# Altium schematic sheet NFCY_BaseBoard.SchDoc: NFCY-BaseBoard
size A3; Author: 怒飞垂云; DrawnBy: 怒飞垂云; Engineer: 怒飞垂云; Organization: NFCY; DocumentNumber: 1; Revision: V2.0; SheetNumber: 1; SheetTotal: 1
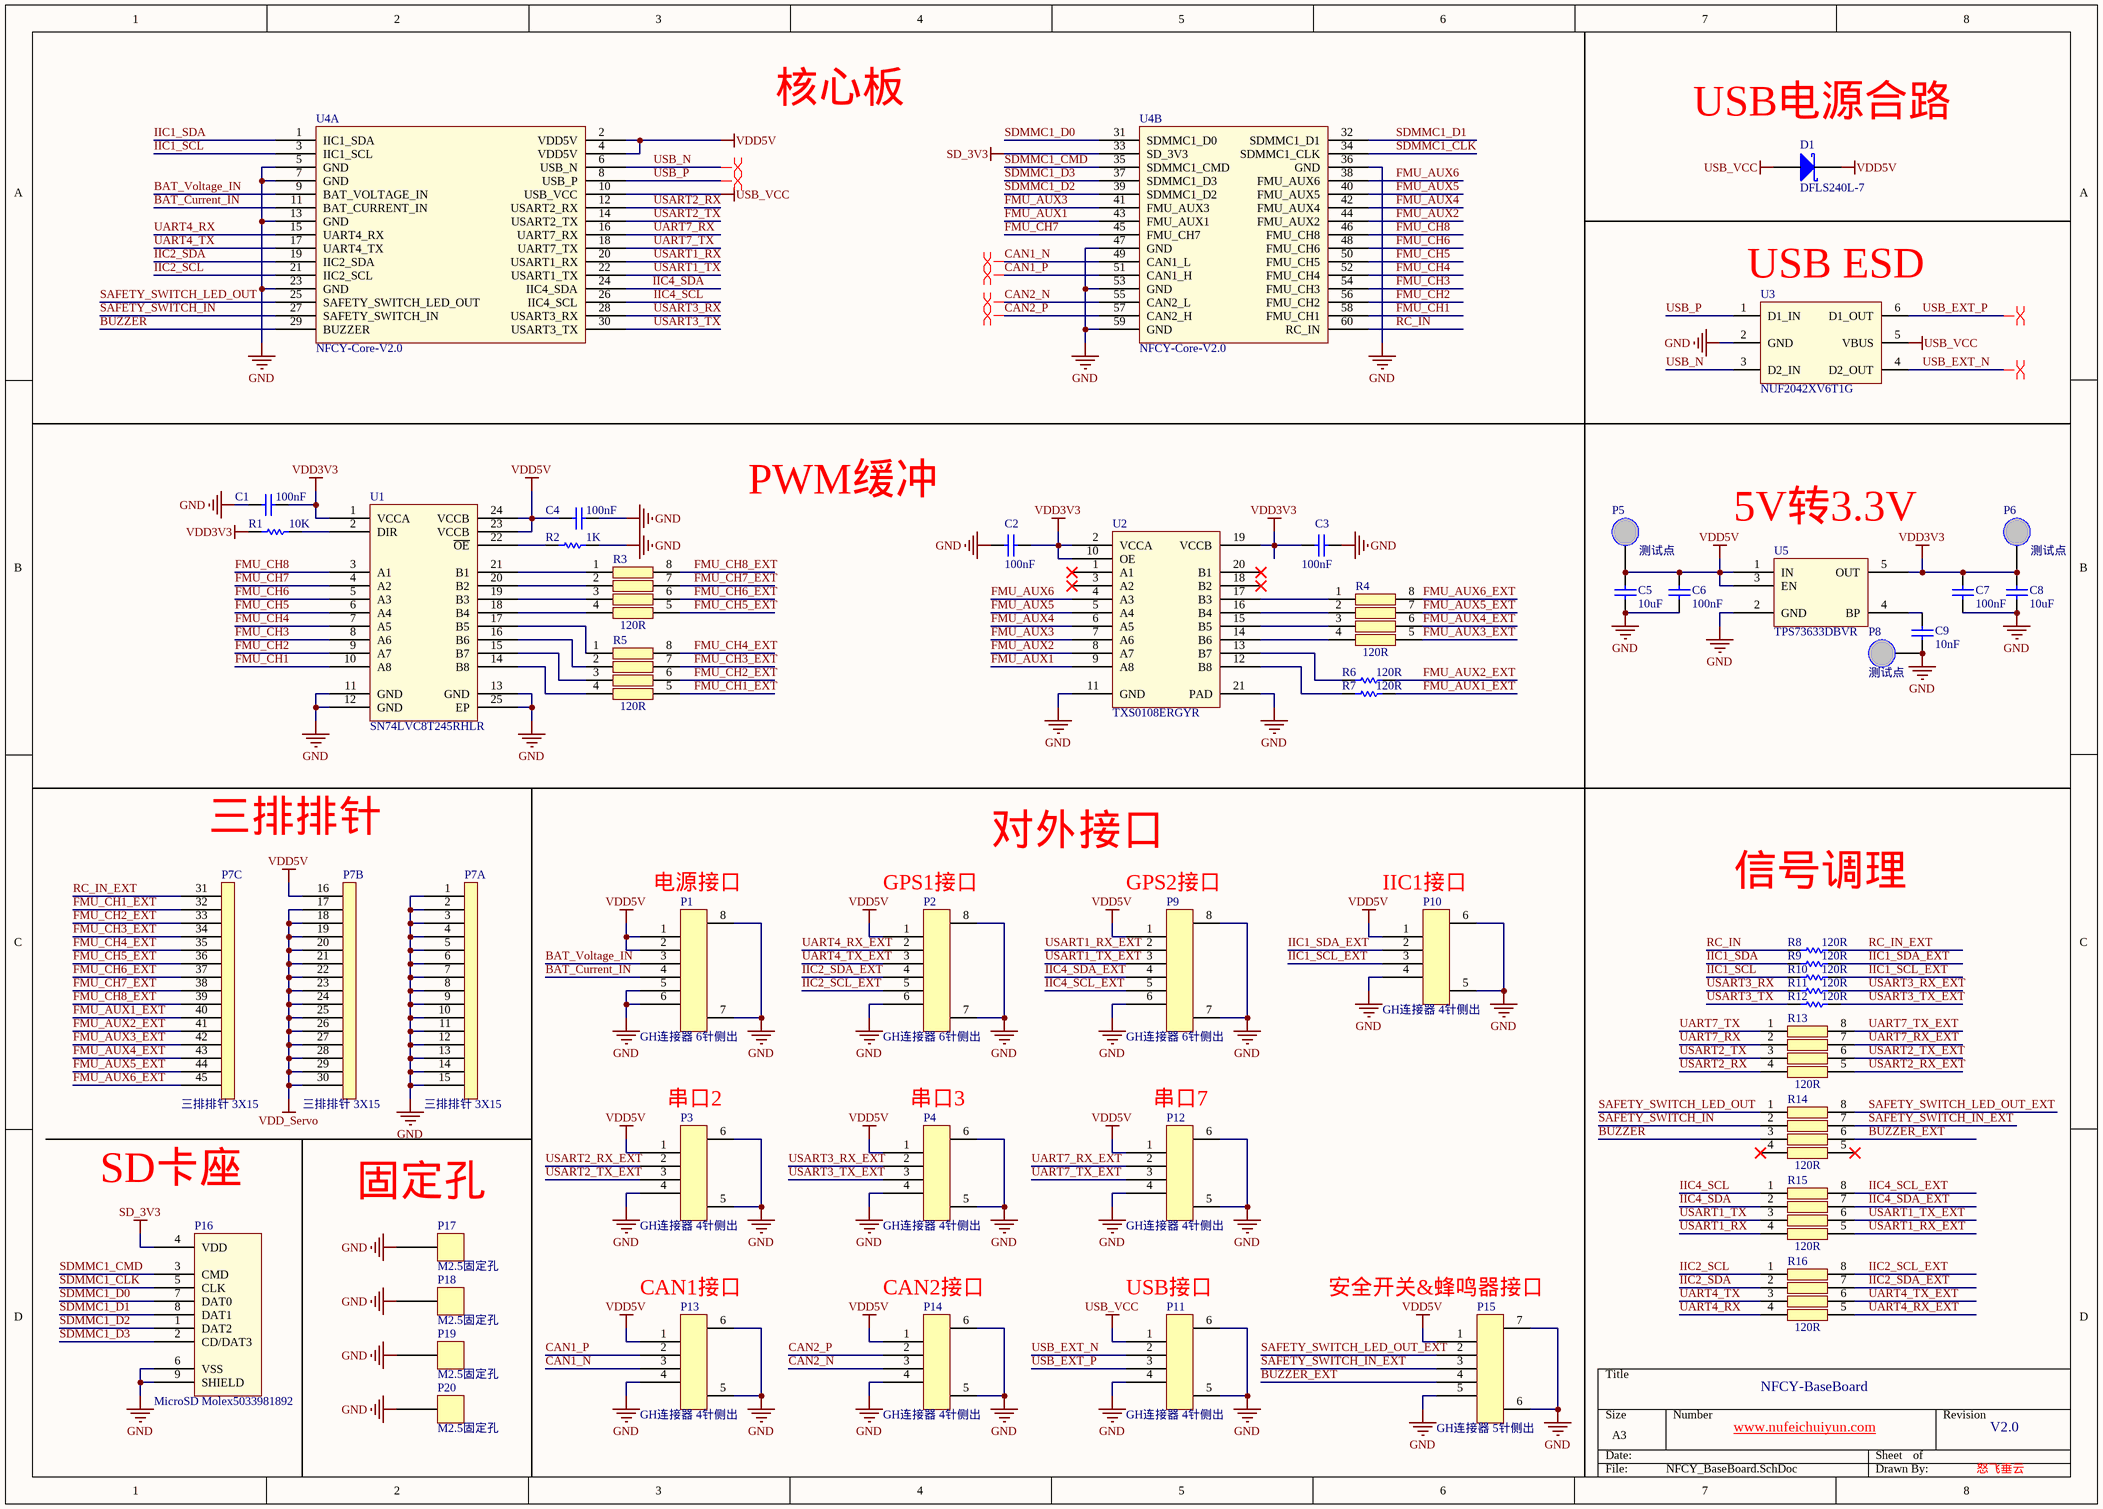
[diagram p0: NFCY_BaseBoard.SchDoc]

## Parts
C1  value 100nF  [CAP0402]  (hidden comment: CL05B104KO5NNNC)
C2  value 100nF  [CAP0402]  (hidden comment: CL05B104KO5NNNC)
C3  value 100nF  [CAP0402]  (hidden comment: CL05B104KO5NNNC)
C4  value 100nF  [CAP0402]  (hidden comment: CL05B104KO5NNNC)
C5  value 10uF  [CAP0805]  (hidden comment: CL21A106KAYNNNE)
C6  value 100nF  [CAP0402]  (hidden comment: CL05B104KO5NNNC)
C7  value 100nF  [CAP0402]  (hidden comment: CL05B104KO5NNNC)
C8  value 10uF  [CAP0805]  (hidden comment: CL21A106KAYNNNE)
C9  value 10nF  [CAP0402]  (hidden comment: CC0402KRX7R9BB103)
D1  DFLS240L-7  [PwerDI123]
P1  GH连接器 6针侧出  [SM06B-GHS-TB]
P2  GH连接器 6针侧出  [SM06B-GHS-TB]
P3  GH连接器 4针侧出  [SM04B-GHS-TB]
P4  GH连接器 4针侧出  [SM04B-GHS-TB]
P5  测试点  [PAD0p8MM]  (no BOM)
P6  测试点  [PAD0p8MM]  (no BOM)
P7  三排排针 3X15  [HDR3X15]  (parts A,B,C of 3)
P8  测试点  [PAD0p8MM]  (no BOM)
P9  GH连接器 6针侧出  [SM06B-GHS-TB]
P10  GH连接器 4针侧出  [SM04B-GHS-TB]
P11  GH连接器 4针侧出  [SM04B-GHS-TB]
P12  GH连接器 4针侧出  [SM04B-GHS-TB]
P13  GH连接器 4针侧出  [SM04B-GHS-TB]
P14  GH连接器 4针侧出  [SM04B-GHS-TB]
P15  GH连接器 5针侧出  [SM05B-GHS-TB]
P16  MicroSD Molex5033981892  [Molex5033981892]
P17  M2.5固定孔  [M2p5]  (no BOM)
P18  M2.5固定孔  [M2p5]  (no BOM)
P19  M2.5固定孔  [M2p5]  (no BOM)
P20  M2.5固定孔  [M2p5]  (no BOM)
R1  value 10K  [RES0402]  (hidden comment: RC0402FR-0710KL)
R2  value 1K  [RES0402]  (hidden comment: RC0402FR-071KL)
R3  value 120R  [RES0402_x4]  (hidden comment: 4D02WGJ0121TCE)
R4  value 120R  [RES0402_x4]  (hidden comment: 4D02WGJ0121TCE)
R5  value 120R  [RES0402_x4]  (hidden comment: 4D02WGJ0121TCE)
R6  value 120R  [RES0402]  (hidden comment: RC0402FR-07120RL)
R7  value 120R  [RES0402]  (hidden comment: RC0402FR-07120RL)
R8  value 120R  [RES0402]  (hidden comment: RC0402FR-07120RL)
R9  value 120R  [RES0402]  (hidden comment: RC0402FR-07120RL)
R10  value 120R  [RES0402]  (hidden comment: RC0402FR-07120RL)
R11  value 120R  [RES0402]  (hidden comment: RC0402FR-07120RL)
R12  value 120R  [RES0402]  (hidden comment: RC0402FR-07120RL)
R13  value 120R  [RES0402_x4]  (hidden comment: 4D02WGJ0121TCE)
R14  value 120R  [RES0402_x4]  (hidden comment: 4D02WGJ0121TCE)
R15  value 120R  [RES0402_x4]  (hidden comment: 4D02WGJ0121TCE)
R16  value 120R  [RES0402_x4]  (hidden comment: 4D02WGJ0121TCE)
U1  SN74LVC8T245RHLR  [VQFN-24]
U2  TXS0108ERGYR  [VQFN-20]
U3  NUF2042XV6T1G  [SOT-563]
U4  NFCY-Core-V2.0  [NFCY-Core-V2]  (parts A,B of 2)
U5  TPS73633DBVR  [SOT23-5]

## Nets
GND: C1.1 C2.2 C3.1 C4.1 C5.2 C6.2 C7.2 C8.2 C9.2 P1.5 P1.6 P1.7 P1.8 P2.6 P2.7 P2.8 P3.4 P3.5 P3.6 P4.4 P4.5 P4.6 P7.1 P7.2 P7.3 P7.4 P7.5 P7.6 P7.7 P7.8 P7.9 P7.10 P7.11 P7.12 P7.13 P7.14 P7.15 P8.1 P9.6 P9.7 P9.8 P10.4 P10.5 P10.6 P11.4 P11.5 P11.6 P12.4 P12.5 P12.6 P13.4 P13.5 P13.6 P14.4 P14.5 P14.6 P15.5 P15.6 P15.7 P16.6(VSS) P16.9(SHIELD) P17.1 P18.1 P19.1 P20.1 R2.2 U1.11(GND) U1.12(GND) U1.13(GND) U1.25(EP) U2.11(GND) U2.21(PAD) U3.2(GND) U4.5(GND) U4.7(GND) U4.13(GND) U4.23(GND) U4.36(GND) U4.47(GND) U4.53(GND) U4.59(GND) U5.2(GND)
SD_3V3: P16.4(VDD) U4.33(SD_3V3)
USB_VCC: D1.2 P11.1 U3.5(VBUS) U4.10(USB_VCC)
VDD3V3: C1.2 C2.1 C3.2 C7.1 C8.1 P6.1 R1.2 U1.1(VCCA) U2.2(VCCA) U2.10(OE) U2.19(VCCB) U5.5(OUT)
VDD5V: C4.2 C5.1 C6.1 D1.1 P1.1 P1.2 P2.1 P3.1 P4.1 P5.1 P7.16 P9.1 P10.1 P12.1 P13.1 P14.1 P15.1 U1.23(VCCB) U1.24(VCCB) U4.2(VDD5V) U4.4(VDD5V) U5.1(IN) U5.3(EN)
VDD_Servo: P7.17 P7.18 P7.19 P7.20 P7.21 P7.22 P7.23 P7.24 P7.25 P7.26 P7.27 P7.28 P7.29 P7.30
BAT_Current_IN: P1.4 U4.11(BAT_CURRENT_IN)
BAT_Voltage_IN: P1.3 U4.9(BAT_VOLTAGE_IN)
BUZZER: R14.3 U4.29(BUZZER)
BUZZER_EXT: P15.4 R14.6
CAN1_N: P13.3 U4.49(CAN1_L)
CAN1_P: P13.2 U4.51(CAN1_H)
CAN2_N: P14.3 U4.55(CAN2_L)
CAN2_P: P14.2 U4.57(CAN2_H)
FMU_AUX1: U2.9(A8) U4.43(FMU_AUX1)
FMU_AUX1_EXT: P7.40 R7.1
FMU_AUX2: U2.8(A7) U4.44(FMU_AUX2)
FMU_AUX2_EXT: P7.41 R6.1
FMU_AUX3: U2.7(A6) U4.41(FMU_AUX3)
FMU_AUX3_EXT: P7.42 R4.5
FMU_AUX4: U2.6(A5) U4.42(FMU_AUX4)
FMU_AUX4_EXT: P7.43 R4.6
FMU_AUX5: U2.5(A4) U4.40(FMU_AUX5)
FMU_AUX5_EXT: P7.44 R4.7
FMU_AUX6: U2.4(A3) U4.38(FMU_AUX6)
FMU_AUX6_EXT: P7.45 R4.8
FMU_CH1: U1.10(A8) U4.58(FMU_CH1)
FMU_CH1_EXT: P7.32 R5.5
FMU_CH2: U1.9(A7) U4.56(FMU_CH2)
FMU_CH2_EXT: P7.33 R5.6
FMU_CH3: U1.8(A6) U4.54(FMU_CH3)
FMU_CH3_EXT: P7.34 R5.7
FMU_CH4: U1.7(A5) U4.52(FMU_CH4)
FMU_CH4_EXT: P7.35 R5.8
FMU_CH5: U1.6(A4) U4.50(FMU_CH5)
FMU_CH5_EXT: P7.36 R3.5
FMU_CH6: U1.5(A3) U4.48(FMU_CH6)
FMU_CH6_EXT: P7.37 R3.6
FMU_CH7: U1.4(A2) U4.45(FMU_CH7)
FMU_CH7_EXT: P7.38 R3.7
FMU_CH8: U1.3(A1) U4.46(FMU_CH8)
FMU_CH8_EXT: P7.39 R3.8
IIC1_SCL: R10.2 U4.3(IIC1_SCL)
IIC1_SCL_EXT: P10.3 R10.1
IIC1_SDA: R9.2 U4.1(IIC1_SDA)
IIC1_SDA_EXT: P10.2 R9.1
IIC2_SCL: R16.1 U4.21(IIC2_SCL)
IIC2_SCL_EXT: P2.5 R16.8
IIC2_SDA: R16.2 U4.19(IIC2_SDA)
IIC2_SDA_EXT: P2.4 R16.7
IIC4_SCL: R15.1 U4.26(IIC4_SCL)
IIC4_SCL_EXT: P9.5 R15.8
IIC4_SDA: R15.2 U4.24(IIC4_SDA)
IIC4_SDA_EXT: P9.4 R15.7
RC_IN: R8.2 U4.60(RC_IN)
RC_IN_EXT: P7.31 R8.1
SAFETY_SWITCH_IN: R14.2 U4.27(SAFETY_SWITCH_IN)
SAFETY_SWITCH_IN_EXT: P15.3 R14.7
SAFETY_SWITCH_LED_OUT: R14.1 U4.25(SAFETY_SWITCH_LED_OUT)
SAFETY_SWITCH_LED_OUT_EXT: P15.2 R14.8
SDMMC1_CLK: P16.5(CLK) U4.34(SDMMC1_CLK)
SDMMC1_CMD: P16.3(CMD) U4.35(SDMMC1_CMD)
SDMMC1_D0: P16.7(DAT0) U4.31(SDMMC1_D0)
SDMMC1_D1: P16.8(DAT1) U4.32(SDMMC1_D1)
SDMMC1_D2: P16.1(DAT2) U4.39(SDMMC1_D2)
SDMMC1_D3: P16.2(CD/DAT3) U4.37(SDMMC1_D3)
UART4_RX: R16.4 U4.15(UART4_RX)
UART4_RX_EXT: P2.2 R16.5
UART4_TX: R16.3 U4.17(UART4_TX)
UART4_TX_EXT: P2.3 R16.6
UART7_RX: R13.2 U4.16(UART7_RX)
UART7_RX_EXT: P12.2 R13.7
UART7_TX: R13.1 U4.18(UART7_TX)
UART7_TX_EXT: P12.3 R13.8
USART1_RX: R15.4 U4.20(USART1_RX)
USART1_RX_EXT: P9.2 R15.5
USART1_TX: R15.3 U4.22(USART1_TX)
USART1_TX_EXT: P9.3 R15.6
USART2_RX: R13.4 U4.12(USART2_RX)
USART2_RX_EXT: P3.2 R13.5
USART2_TX: R13.3 U4.14(USART2_TX)
USART2_TX_EXT: P3.3 R13.6
USART3_RX: R11.2 U4.28(USART3_RX)
USART3_RX_EXT: P4.2 R11.1
USART3_TX: R12.2 U4.30(USART3_TX)
USART3_TX_EXT: P4.3 R12.1
USB_EXT_N: P11.2 U3.4(D2_OUT)
USB_EXT_P: P11.3 U3.6(D1_OUT)
USB_N: U3.3(D2_IN) U4.6(USB_N)
USB_P: U3.1(D1_IN) U4.8(USB_P)
NetC9_1: C9.1 U5.4(BP)
NetR1_1: R1.1 U1.2(DIR)
NetR2_1: R2.1 U1.22(~{OE})
NetR3_1: R3.1 U1.21(B1)
NetR3_2: R3.2 U1.20(B2)
NetR3_3: R3.3 U1.19(B3)
NetR3_4: R3.4 U1.18(B4)
NetR4_1: R4.1 U2.17(B3)
NetR4_2: R4.2 U2.16(B4)
NetR4_3: R4.3 U2.15(B5)
NetR4_4: R4.4 U2.14(B6)
NetR5_1: R5.1 U1.17(B5)
NetR5_2: R5.2 U1.16(B6)
NetR5_3: R5.3 U1.15(B7)
NetR5_4: R5.4 U1.14(B8)
NetR6_2: R6.2 U2.13(B7)
NetR7_2: R7.2 U2.12(B8)

Not connected (* = marked no-connect by the designer): R14 4* 5*; U2 1(A1)* 3(A2)* 18(B2)* 20(B1)*

## Layout directives
differential pair: CAN1_N, CAN1_P, CAN2_N, CAN2_P, USB_EXT_N, USB_EXT_P, USB_N, USB_P

## Notes on the sheet
- 核心板
- (near D1) USB电源合路
- (near U3) USB ESD
- PWM缓冲
- (near U5) 5V转3.3V
- 三排排针
- 对外接口
- (near P1) 电源接口
- (near P2) GPS1接口
- (near P9) GPS2接口
- (near P10) IIC1接口
- 信号调理
- (near P3) 串口2
- (near P4) 串口3
- (near P12) 串口7
- SD卡座
- (near P17) 固定孔
- (near P13) CAN1接口
- (near P14) CAN2接口
- (near P11) USB接口
- (near P15) 安全开关&蜂鸣器接口
- www.nufeichuiyun.com <http://www.nufeichuiyun.com>

## Library data of the parts
C1-C8 = Cap: 贴片电容; manufacturer: SAMSUNG(三星); Published: 8-Jun-2000; LatestRevisionDate: 17-Jul-2002; LatestRevisionNote: Re-released for DXP Platform.; PackageReference: RAD-0.3; Publisher: Altium Limited; PackageDescription: Radial Cap, Thru-Hole; 2 Leads; 0.3 in Pin Spacing
C9 = Cap: 贴片电容; manufacturer: YAGEO(国巨); Published: 8-Jun-2000; LatestRevisionDate: 17-Jul-2002; LatestRevisionNote: Re-released for DXP Platform.; PackageReference: RAD-0.3; Publisher: Altium Limited; PackageDescription: Radial Cap, Thru-Hole; 2 Leads; 0.3 in Pin Spacing
D1 = DFLS240L-7: 肖特基二极管; manufacturer: DIODES(美台)
P1 P2 P9 = GH_6PIN: 连接器; manufacturer: JST
P3 P4 P10-P14 = GH_4PIN: 连接器; manufacturer: JST
P5 P6 P8 = TestPad
P7 = 三排排针 3X15: 排针
P15 = GH_5PIN: 连接器; manufacturer: JST
P16 = MicroSD Molex5033981892: MicroSD卡座; manufacturer: Molex
P17-P20 = Pad
R1 R2 R6-R12 = Res1: 贴片电阻; manufacturer: YAGEO(国巨); Published: 8-Jun-2000; LatestRevisionDate: 17-Jul-2002; LatestRevisionNote: Re-released for DXP Platform.; PackageReference: AXIAL-0.3; Publisher: Altium Limited; PackageDescription: Axial Device, Thru-Hole; 2 Leads; 0.3 in Pin Spacing
R3-R5 R13-R16 = 排阻_x4: 排阻; manufacturer: RALEC(旺诠)
U1 = SN74LVC8T245RHLR: 8bit缓冲器芯片; manufacturer: TI
U2 = TXS0108ERGYR: 8位电平转换芯片; manufacturer: TI
U3 = NUF2042XV6T1G: USB ESD保护芯片; manufacturer: ON(安森美)
U4 = NFCY-Core-V2.0: 怒飞垂云飞控核心模块; manufacturer: 怒飞垂云
U5 = TPS73633DBVR: LDO芯片; manufacturer: TI